# EAGLE design FubarinoMini_v10 (EAGLE 5.10)
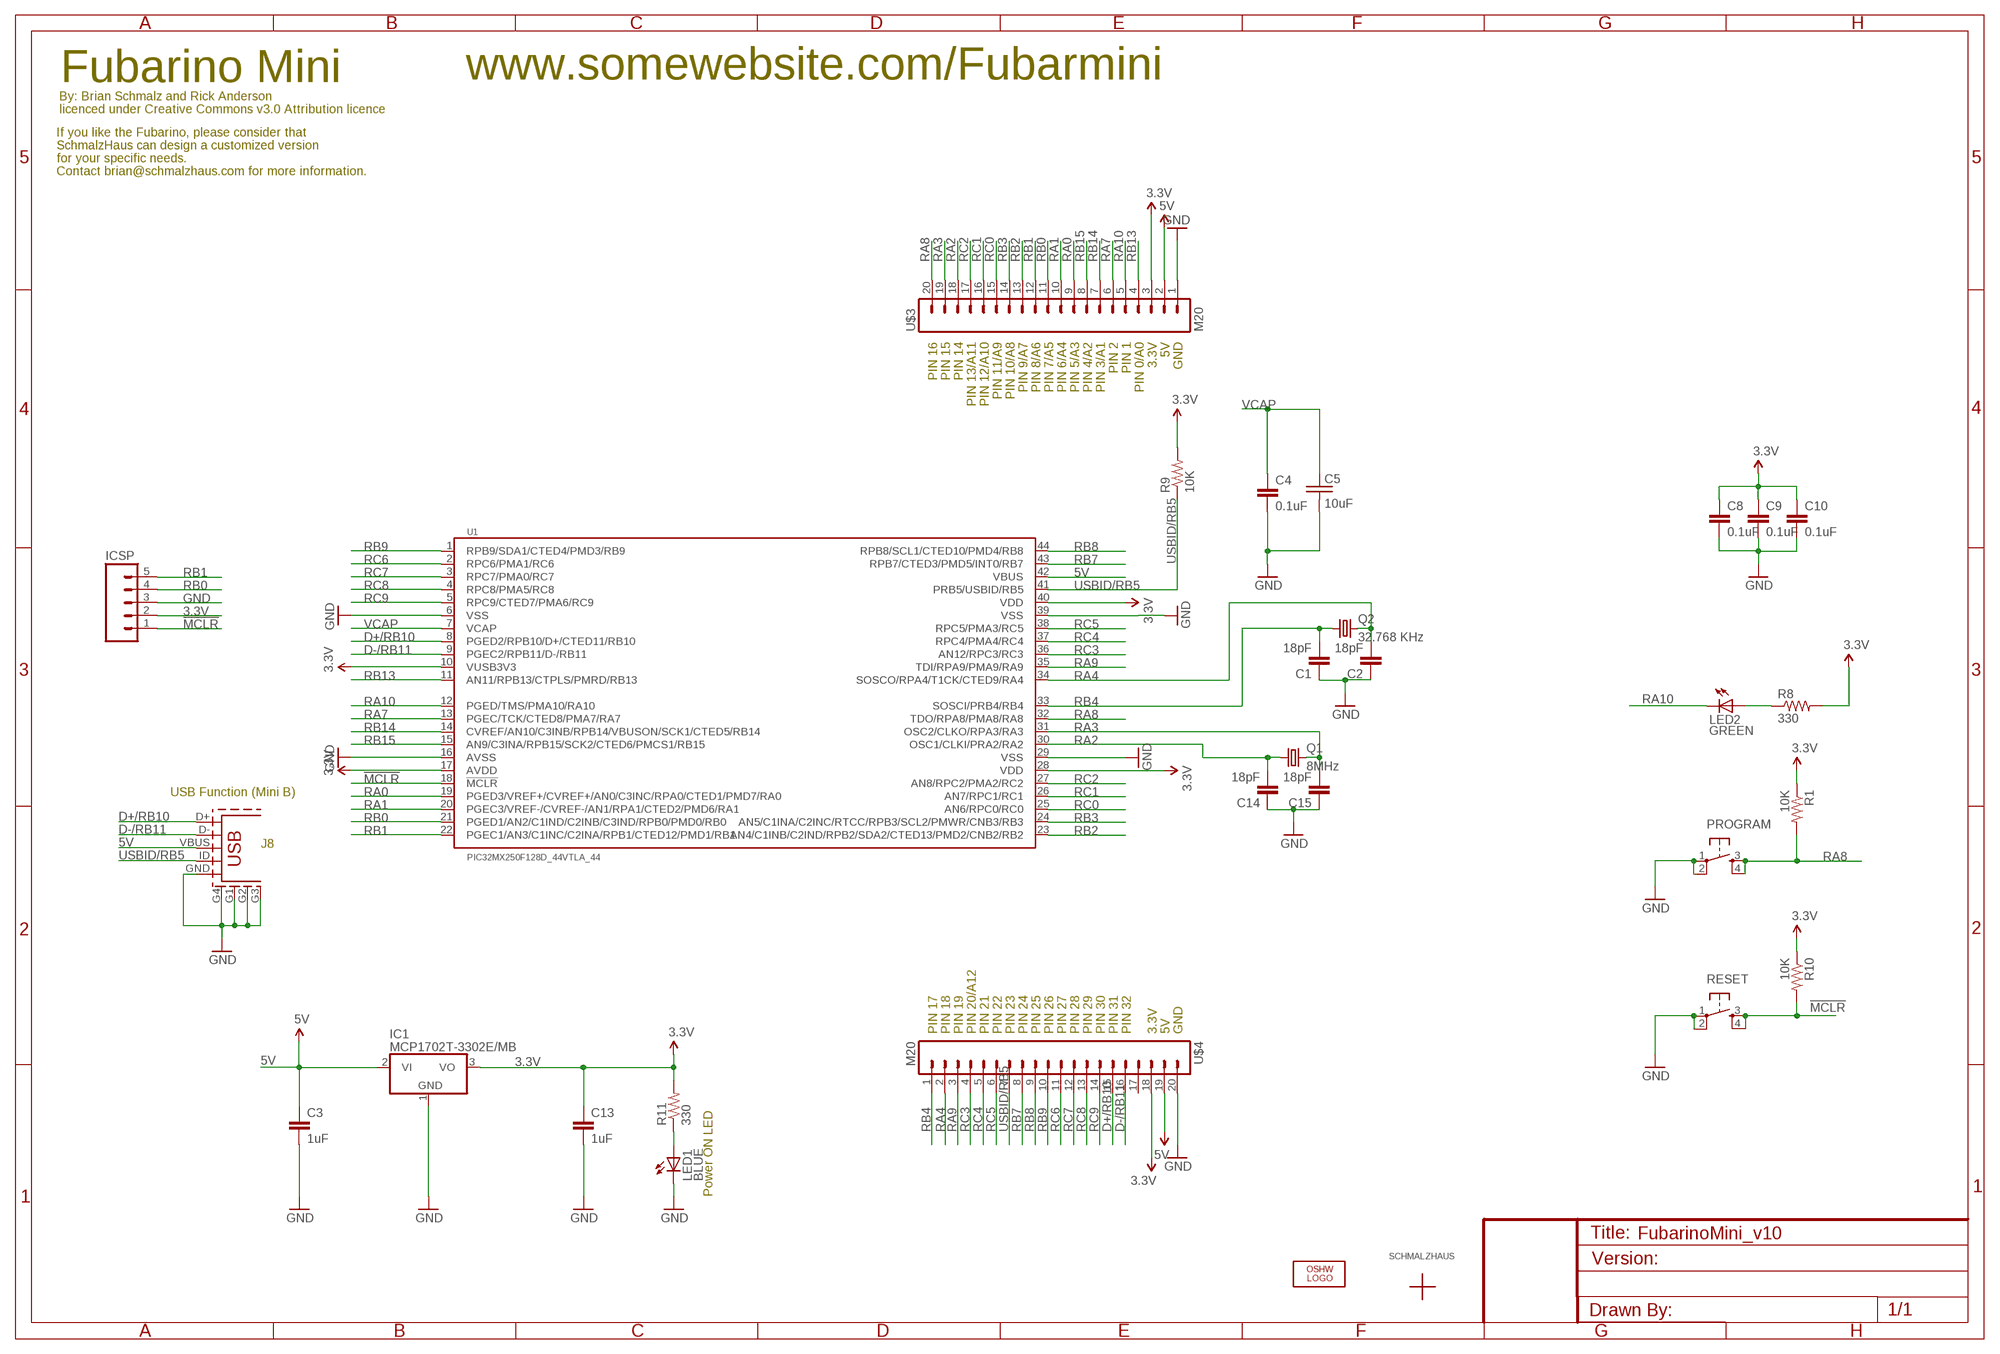
[diagram p0: schematic, sheet 1]

## Parts
C1  18pF  CAP0603-CAP  [0603-CAP]
C2  18pF  CAP0603-CAP  [0603-CAP]
C3  1uF  CAP0603-CAP  [0603-CAP]
C4  0.1uF  CAP0603-CAP  [0603-CAP]
C5  10uF  CAP0805  [CAP_0805]
C8  0.1uF  CAP0603-CAP  [0603-CAP]
C9  0.1uF  CAP0603-CAP  [0603-CAP]
C10  0.1uF  CAP0603  [0603]
C13  1uF  CAP0603  [0603]
C14  18pF  CAP0603-CAP  [0603-CAP]
C15  18pF  CAP0603-CAP  [0603-CAP]
IC1  MCP1702T-3302E/MB  MCP170333MB  [SOT89]
ICSP  M05NOSLILK  [1X05_NOSILK]
J8  USB_5PIN  [USB-MINIB]
LED1  BLUE  LED0603  [LED-0603]
LED2  GREEN  LED0603  [LED-0603]
LOGO1  OSHW_LOGO_8MILX0070-NT  [OSHW_8X70_NOTEXT]
PROGRAM  TAC_SWITCHSND  [TACTILE_SWITCH_SMD]
Q1  8MHz  CRYSTALNX5032  [NX5032_5MM_3.2MM_CRYSTAL]
Q2  32.768 KHz  CRYSTALTC26H  [TC26H]
R1  10K  RESISTOR0603-RES  [0603-RES]
R8  330  RESISTOR0603-RES  [0603-RES]
R9  10K  RESISTOR0603-RES  [0603-RES]
R10  10K  RESISTOR0603-RES  [0603-RES]
R11  330  RESISTOR0603-RES  [0603-RES]
RESET  TAC_SWITCHSND  [TACTILE_SWITCH_SMD]
U1  PIC32MX250F128D_44VTLA_44  PIC32MX2XX_44VLA_44  [VTLA_44]
U$1  SCHMALZHAUSSCHMALZHAUS_SMALL  [SCHMALZHAUS_SMALL]
U$3  M20  [1X20_NO_PIN1]
U$4  M20  [1X20_NO_PIN1]

## Nets
3.3V: C8.1 C9.1 C10.1 C13.1 IC1.3(VO) ICSP.2 R1.1 R8.2 R9.2 R10.1 R11.2 U1.10(VUSB3V3) U1.17(AVDD) U1.28(VDD) U1.40(VDD) U$3.3 U$4.18
5V: C3.1 IC1.2(VI) IC1.2@1(VI1) J8.VBUS U1.42(VBUS) U$3.2 U$4.19
!MCLR!: ICSP.1 R10.2 RESET.3 RESET.4 U1.18(!MCLR!)
D+/RB10: J8.D+ U1.8(PGED2/RPB10/D+/CTED11/RB10) U$4.15
D-/RB11: J8.D- U1.9(PGEC2/RPB11/D-/RB11) U$4.16
GND: C1.1 C2.1 C3.2 C4.2 C5.2 C8.2 C9.2 C10.2 C13.2 C14.1 C15.1 IC1.1(GND) ICSP.3 J8.G1 J8.G2 J8.G3 J8.G4(SHIELD) J8.GND LED1.C PROGRAM.1 PROGRAM.2 RESET.1 RESET.2 U1.6(VSS) U1.16(AVSS) U1.29(VSS) U1.39(VSS) U$3.1 U$4.20
N$6: LED1.A R11.1
N$20: LED2.A R8.1
RA0: U1.19(PGED3/VREF+/CVREF+/AN0/C3INC/RPA0/CTED1/PMD7/RA0) U$3.9
RA1: U1.20(PGEC3/VREF-/CVREF-/AN1/RPA1/CTED2/PMD6/RA1) U$3.10
RA2: C14.2 Q1.1 U1.30(OSC1/CLKI/PRA2/RA2) U$3.18
RA3: C15.2 Q1.2 U1.31(OSC2/CLKO/RPA3/RA3) U$3.19
RA4: C2.2 Q2.2 U1.34(SOSCO/RPA4/T1CK/CTED9/RA4) U$4.2
RA7: U1.13(PGEC/TCK/CTED8/PMA7/RA7) U$3.6
RA8: PROGRAM.3 PROGRAM.4 R1.2 U1.32(TDO/RPA8/PMA8/RA8) U$3.20
RA9: U1.35(TDI/RPA9/PMA9/RA9) U$4.3
RA10: LED2.C U1.12(PGED/TMS/PMA10/RA10) U$3.5
RB0: ICSP.4 U1.21(PGED1/AN2/C1IND/C2INB/C3IND/RPB0/PMD0/RB0) U$3.11
RB1: ICSP.5 U1.22(PGEC1/AN3/C1INC/C2INA/RPB1/CTED12/PMD1/RB1) U$3.12
RB2: U1.23(AN4/C1INB/C2IND/RPB2/SDA2/CTED13/PMD2/CNB2/RB2) U$3.13
RB3: U1.24(AN5/C1INA/C2INC/RTCC/RPB3/SCL2/PMWR/CNB3/RB3) U$3.14
RB4: C1.2 Q2.1 U1.33(SOSCI/PRB4/RB4) U$4.1
RB7: U1.43(RPB7/CTED3/PMD5/INT0/RB7) U$4.8
RB8: U1.44(RPB8/SCL1/CTED10/PMD4/RB8) U$4.9
RB9: U1.1(RPB9/SDA1/CTED4/PMD3/RB9) U$4.10
RB13: U1.11(AN11/RPB13/CTPLS/PMRD/RB13) U$3.4
RB14: U1.14(CVREF/AN10/C3INB/RPB14/VBUSON/SCK1/CTED5/RB14) U$3.7
RB15: U1.15(AN9/C3INA/RPB15/SCK2/CTED6/PMCS1/RB15) U$3.8
RC0: U1.25(AN6/RPC0/RC0) U$3.15
RC1: U1.26(AN7/RPC1/RC1) U$3.16
RC2: U1.27(AN8/RPC2/PMA2/RC2) U$3.17
RC3: U1.36(AN12/RPC3/RC3) U$4.4
RC4: U1.37(RPC4/PMA4/RC4) U$4.5
RC5: U1.38(RPC5/PMA3/RC5) U$4.6
RC6: U1.2(RPC6/PMA1/RC6) U$4.11
RC7: U1.3(RPC7/PMA0/RC7) U$4.12
RC8: U1.4(RPC8/PMA5/RC8) U$4.13
RC9: U1.5(RPC9/CTED7/PMA6/RC9) U$4.14
USBID/RB5: J8.ID(USB_ID) R9.1 U1.41(PRB5/USBID/RB5) U$4.7
VCAP: C4.1 C5.1 U1.7(VCAP)
Unconnected: U$4.17

## Notes on the sheet
- Fubarino Mini | www.somewebsite.com/Fubarmini
- By: Brian Schmalz and Rick Anderson
- licenced under Creative Commons v3.0 Attribution licence
- If you like the Fubarino, please consider that
- SchmalzHaus can design a customized version
- for your specific needs.
- Contact brian@schmalzhaus.com for more information.
- PIN 16 | PIN 15 | PIN 14 | PIN 13/A11 | PIN 12/A10 | PIN 11/A9 | PIN 10/A8 | PIN 9/A7 | PIN 8/A6 | PIN 7/A5 | PIN 6/A4 | PIN 5/A3 | PIN 4/A2 | PIN 3/A1 | PIN 2 | PIN 1 | PIN 0/A0 | 3.3V | 5V | GND
- USB Function (Mini B)
- J8
- PIN 17 | PIN 18 | PIN 19 | PIN 20/A12 | PIN 21 | PIN 22 | PIN 23 | PIN 24 | PIN 25 | PIN 26 | PIN 27 | PIN 28 | PIN 29 | PIN 30 | PIN 31 | PIN 32 | 3.3V | 5V | GND
- Power ON LED

## Library data of the parts
C1-C4 C8 C9 C14 C15 = SparkFun:CAP: Capacitor Standard 0603 ceramic capacitor, and 0.1" leaded capacitor.
C5 = SchmalzHaus:CAP
C10 C13 = SparkFun02-20-08:CAP: Capacitor Standard 0603 ceramic capacitor, and 0.1" leaded capacitor.
IC1 = linear:MCP1703*: 250 mA, 16V, Low Quiescent Current LDO Regulator Source: http://ww1.microchip.com/downloads/en/DeviceDoc/22049b.pdf
ICSP = SchmalzHaus:M05: Header 5 Standard 5-pin 0.1" header. Use with straight break away headers (SKU : PRT-00116), right angle break away headers (PRT-00553), swiss pins (PRT-00743), machine pins (PRT-00117), and female headers (PRT-00115). Molex polarized connector foot print use with SKU : PRT-08230 with associated crimp pins and housings.
J8 = SparkFun02-20-08:USB_5PIN
LED1 LED2 = SparkFun:LED: LEDs Standard schematic elements and footprints for 5mm, 3mm, 1206, and 0603 sized LEDs. 5mm - Spark Fun Electronics SKU : COM-00529 (and others)
LOGO1 = OSHW:OSHW_LOGO_8MIL
PROGRAM RESET = SparkFun02-20-08:TAC_SWITCH: Momentary Switch Button commonly used for reset or general input. Spark Fun Electronics SKU : COM-00097
Q1 Q2 = SchmalzHaus:CRYSTAL: Crystals Various standard crystals. Proven footprints. Spark Fun Electronics SKU : COM-00534
R1 R8-R11 = SparkFun:RESISTOR: Resistor Basic schematic elements and footprints for 0603, 1206, and PTH resistors.
U1 = SchmalzHaus:PIC32MX2XX_44
U$1 = SchmalzHaus:SCHMALZHAUS
U$3 U$4 = SchmalzHaus:M20

## Board
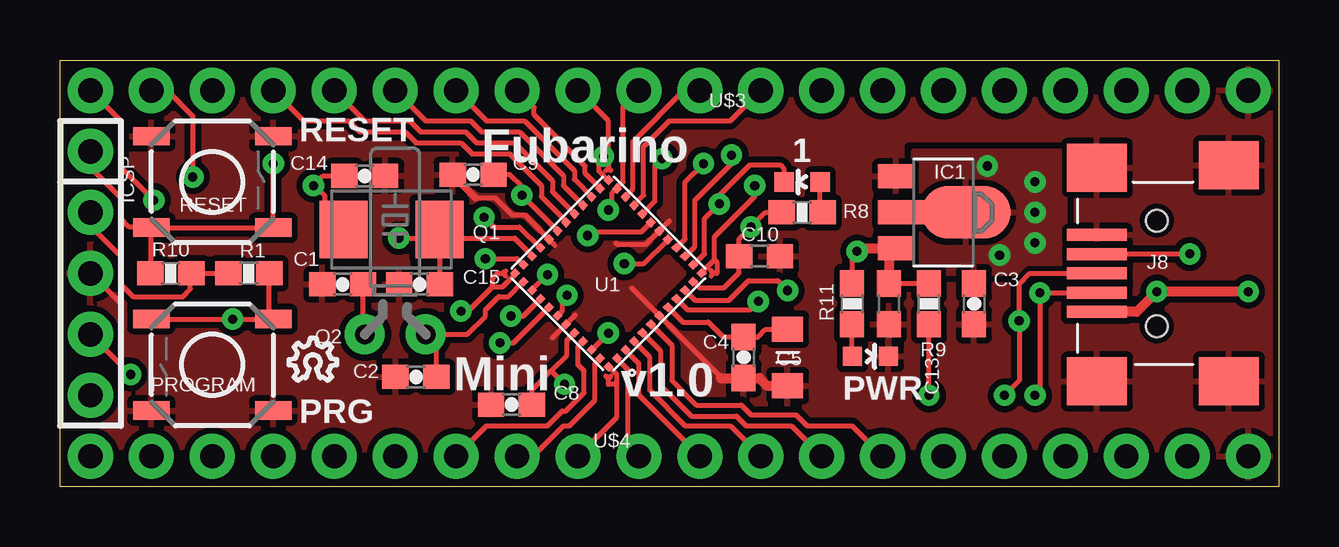
[diagram p1: board, top side]
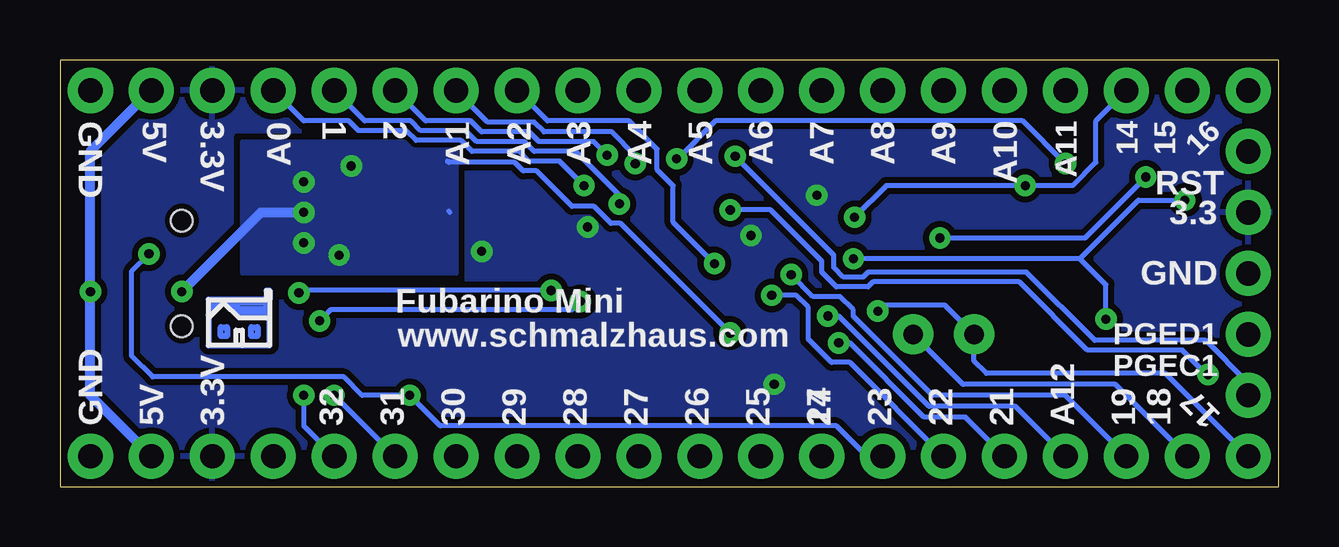
[diagram p2: board, bottom side, seen from below]

Size 50.8 x 17.78 mm. Coordinates in mm from the lower left corner, seen from the top.
Outline: 0,17.78 50.8,17.78 50.8,0 0,0 0,17.78
Copper layers (1*16): Top 0.035mm / dielectric 1.5mm / Bottom 0.035mm
Design rules "GoldPhoenix_8and8": minimum track width 7mil, minimum drill 15mil, track to track 8mil, track to pad 8mil, pad to pad 8mil, via to via 8mil, smd to smd 8mil, copper to edge 10mil, drill to drill 8mil, minimum pad ring 12mil, minimum via ring 10mil, stop-mask expansion 4mil, vias tented up to drill 25mil, thermal gap 10mil

### Footprints (pad centres in the part's own frame; a part is rotated, then mirrored left to right if it is on the bottom)
0603-CAP = smd 1.1 x 1: 1 -0.85,0; 2 0.85,0
CAP_0805 = smd 1.05 x 1.3: 1 -1.175,0; 2 1.175,0
0603 = smd 1.1 x 1: 1 -0.85,0; 2 0.85,0
SOT89 = smd 1 x 1.5: 1 -1.499,-1.981; 3 1.499,-1.981 | smd 1 x 2: 2 0,-1.727 | smd 2.2 x 3.7: 2@1 0,0.94
1X05_NOSILK = drill 1.016 pad 1.88 round: 1 0,0; 2 2.54,0; 3 5.08,0; 4 7.62,0; 5 10.16,0
USB-MINIB = smd 2.5 x 0.5: D+ 2.5,0; D- 2.5,0.8; GND 2.5,-1.6; ID 2.5,-0.8; VBUS 2.5,1.6 | smd 2.5 x 2: G1 -3,4.5; G2 2.5,4.5; G3 -3,-4.5; G4 2.5,-4.4 | hole 0.9: 0,2.2; 0,-2.2
LED-0603 = smd 0.8 x 0.8: A 0,-0.75; C 0,0.75
TACTILE_SWITCH_SMD = smd 1.524 x 0.762: 1 -2.54,1.905; 2 2.54,1.905; 3 -2.54,-1.905; 4 2.54,-1.905
NX5032_5MM_3.2MM_CRYSTAL = smd 2 x 2.4: 1 -2,0; 2 2,0
TC26H = drill 0.813 pad 1.676 round: 1 -1.27,0; 2 1.27,0
0603-RES = smd 1.1 x 1: 1 -0.85,0; 2 0.85,0
VTLA_44 = smd 0.3 x 0.3: 1 -2.75,2.25; 2 -2.75,1.75; 3 -2.75,1.25; 4 -2.75,0.75; 5 -2.75,0.25; 6 -2.75,-0.25; 7 -2.75,-0.75; 8 -2.75,-1.25; 9 -2.75,-1.75; 10 -2.75,-2.25; 11 -2.75,-2.75; 12 -2.25,-2.75; 13 -1.75,-2.75; 14 -1.25,-2.75; 15 -0.75,-2.75; 16 -0.25,-2.75; 17 0.25,-2.75; 18 0.75,-2.75; 19 1.25,-2.75; 20 1.75,-2.75; 21 2.25,-2.75; 22 2.75,-2.75; 23 2.75,-2.25; 24 2.75,-1.75; 25 2.75,-1.25; 26 2.75,-0.75; 27 2.75,-0.25; 28 2.75,0.25; 29 2.75,0.75; 30 2.75,1.25; 31 2.75,1.75; 32 2.75,2.25; 33 2.75,2.75; 34 2.25,2.75; 35 1.75,2.75; 36 1.25,2.75; 37 0.75,2.75; 38 0.25,2.75; 39 -0.25,2.75; 40 -0.75,2.75; 41 -1.25,2.75; 42 -1.75,2.75; 43 -2.25,2.75; 44 -2.75,2.75
1X20_NO_PIN1 = drill 1.016 pad 1.88 round: 1 -24.13,0; 2 -21.59,0; 3 -19.05,0; 4 -16.51,0; 5 -13.97,0; 6 -11.43,0; 7 -8.89,0; 8 -6.35,0; 9 -3.81,0; 10 -1.27,0; 11 1.27,0; 12 3.81,0; 13 6.35,0; 14 8.89,0; 15 11.43,0; 16 13.97,0; 17 16.51,0; 18 19.05,0; 19 21.59,0; 20 24.13,0

### Placement (x,y rotation side)
C1  11.79,8.43 0 top
C2  14.83,4.57 0 top
C3  38.1,7.62 270 top
C4  28.5,5.38 270 top
C5  30.33,5.38 270 top
C8  18.82,3.42 180 top
C9  17.22,13 180 top
C10  29.16,9.6 0 top
C13  34.54,7.62 270 top
C14  12.7,12.95 180 top
C15  14.99,8.43 0 top
IC1  36.83,11.43 270 top
ICSP  1.27,13.97 270 top
J8  45.72,8.89 180 top
LED1  33.78,5.44 270 top
LED2  30.94,12.7 90 top
LOGO1  9.55,4.42 0 top
PROGRAM  6.35,5.08 180 top
Q1  13.82,10.72 0 top
Q2  13.97,6.35 0 top
R1  7.87,8.89 0 top
R8  30.94,11.43 180 top
R9  36.22,7.62 90 top
R10  4.62,8.89 180 top
R11  33.02,7.62 90 top
RESET  6.35,12.7 0 top
U1  22.86,8.89 135 top
U$1  43.33,5.89 0 bottom
U$3  25.4,16.51 180 top
U$4  25.4,1.27 0 top

### Tracks (layer width: path | path; a pad name or v marks a point on that pad's centre or on a via)
3.3V  (via drill 0.38)
  Top 0.203: ICSP.2 1.27,10.87 2.54,9.6 2.54,8.43 3.05,7.92 5.13,7.92 5.44,8.23 5.44,8.85 R10.1 R1.1 | U1.28 v19.25,12.14 19.25,12.5 18.75,13.01 C9.1 | U1.40 21.13,6.1 21.13,5.49 20.47,4.83 | C13.1 R9.2 | U1.17 24.23,10.62 22.15,10.62 v22,10.46 | U1.10 26.41,8.54 26.67,8.28 27.67,8.28 28.31,8.92 C10.1 28.31,10.33 v28.8,10.82 29.41,11.43 R8.2 | 33.33,9.91 v33.22,9.8 33.02,9.6 R11.2 | IC1.3 34.54,9.63 | C8.1 19.67,4.02 20.47,4.83 | 20.47,4.83 v21.03,4.27
  Top 0.406: IC1.3 34.82,9.91 33.33,9.91 | 34.54,9.63 C13.1
  Bottom 0.203: v22,10.46 22,10.21
  pour Bottom (isolate 0.254, rank 3): 0,0 0,17.78 50.8,17.78 50.8,0
5V  (via drill 0.38)
  Top 0.203: U1.42 22.17,5.71 v22.86,6.4
  Top 0.406: J8.VBUS 44.88,7.29 v45.72,8.13 v49.53,8.13
  Bottom 0.203: v49.53,8.13 49.48,8.13 49.53,8.08 | 34.59,11.48 34.54,11.43 | v22.86,6.4 27.43,10.97 27.84,10.97 28.55,11.68 29.46,11.68 30.94,13.16 31.5,13.16 31.85,13.51 34.59,13.51 34.65,13.56
  Bottom 0.406: U$3.2 49.53,13.97 49.53,8.08 49.53,3.81 U$4.19 | v45.72,8.13 42.42,11.43 v40.64,11.43
  other vias: 40.64,12.7 40.64,10.16 38.66,13.36 39.17,9.65
  pour Top: 35.56,8.89 41.91,8.89 41.91,13.97 35.56,13.97
  pour Bottom: 34.29,14.38 34.29,8.89 43.18,8.89 43.18,14.38
!MCLR!  (via drill 0.38)
  Top 0.203: RESET.3 RESET.4 v8.89,13.46 | U1.18 24.27,11.37 24.79,11.89 24.79,13.36 v25.09,13.66 | RESET.3 3.81,8.93 R10.2 | ICSP.1 1.27,13.31 2.54,12.04 2.54,11.18 2.9,10.82 3.79,10.82 RESET.3
  Bottom 0.203: v8.89,13.46 10.67,15.24 23.47,15.24 25.04,13.66 v25.09,13.66
D+/RB10  (via drill 0.38)
  Top 0.203: U1.8 26.16,7.37 28.75,7.37 v29.11,7.72 | J8.D+ 40.44,8.89 39.98,8.43 v39.98,6.91 39.98,4.42 v39.37,3.81
  Bottom 0.203: v29.11,7.72 29.46,7.37 39.52,7.37 v39.98,6.91 | v39.37,3.81 U$4.15
D-/RB11  (via drill 0.38)
  Top 0.203: U1.9 26.06,8.18 26.47,7.77 27.89,7.77 28.7,8.59 29.92,8.59 v30.33,8.18 | J8.D- 43.21,8.08 v40.84,8.08 40.84,4.01 v40.64,3.81
  Bottom 0.203: v30.33,8.18 40.74,8.18 v40.84,8.08 | v40.64,3.81 40.64,2.54 U$4.16
GND
  Top 0.203: U1.29 | U1.16 | U1.16 25.4,11.07 | U1.29 20.62,10.06 | 23.82,8.28 U1.6 27.53,4.57 27.53,4.52 | ICSP.3 2.44,7.72 | 21.49,7.16 U1.39 20.52,6.2 | C5.2 | U1.29 19.36,11.33 18.85,11.33 18.14,12.04 17.32,12.04 | 16.51,12.85 16.51,12.87 C9.2 | U1.16 24.43,10.11 23.22,10.11 23.16,10.16
  Top 0.305: 17.32,12.04 16.51,12.85
  Top 0.406: 27.53,4.52 29.16,4.52 29.46,4.22 C5.2
  pour Top (isolate 0.254, rank 4): 0,17.78 0,0 50.8,0 50.8,17.78
N$6
  Top 0.203: R11.1 LED1.A
N$20
  Top 0.203: LED2.A 31.69,11.53 R8.1
RA0
  Top 0.203: U1.19 24.33,12.14 24.33,14.17 25.4,15.24 27.94,15.24 U$3.9
RA1
  Top 0.203: U1.20 23.57,12.09 23.88,12.39 23.88,14.38 26.01,16.51 U$3.10
RA2  (via drill 0.38)
  Top 0.203: U1.30 19.15,10.82 18.09,10.82 v17.68,11.23 | C14.2 10.97,12.95 v10.57,12.55 10.62,12.55 11.02,12.14 11.02,11.51 Q1.1
  Bottom 0.203: v17.68,11.23 16.36,12.55 v10.57,12.55 8.59,12.55 7.62,13.51 7.62,15.24 U$3.18
RA3  (via drill 0.38)
  Top 0.203: U1.31 19.68,9.63 18.95,10.36 16.17,10.36 Q1.2 | Q1.2 15.82,8.45 C15.2 | Q1.2 15.7,10.72 15.34,10.36 v14.12,10.36 | v5.54,12.9 5.54,15.44 4.47,16.51 U$3.19
  Bottom 0.203: v14.12,10.36 8.08,10.36 v5.54,12.9
RA4
  Top 0.203: 19.32,8.55 U1.34 19.31,8.54 18.69,7.92 18.29,7.92 17.73,7.37 17.73,7.11 16.97,6.35 Q2.2 15.68,5.91 C2.2
  Bottom 0.203: U$4.2 6.81,4.27 13.16,4.27 Q2.2
RA7  (via drill 0.38)
  Top 0.203: U1.13 26.04,9.58 26.47,10.01 26.47,11.94 27.99,13.46 v27.99,13.82
  Bottom 0.203: v27.99,13.82 28.55,14.38 30.84,14.38 31.24,14.78 33.22,14.78 33.68,15.24 35.56,15.24 U$3.6
RA8  (via drill 0.38)
  Top 0.203: U1.32 19.31,9.24 19.05,9.5 v17.73,9.5 | PROGRAM.4 v7.2,6.99 PROGRAM.3 8.72,7.15 R1.2 | v3.91,11.94 2.54,13.31 2.54,15.24 U$3.20
  Bottom 0.203: 8.28,9.5 v17.73,9.5 | v7.2,6.99 7.2,8.42 8.28,9.5 | 8.28,9.5 5.84,11.94 v3.91,11.94
RA9  (via drill 0.38)
  Top 0.203: 19.66,8.18 U1.35 19.68,8.2 v20.32,8.84
  Bottom 0.203: U$4.3 8.89,3.81 14.43,3.81 17.73,7.11 17.73,7.37 18.29,7.92 19.41,7.92 v20.32,8.84
RA10  (via drill 0.38)
  Top 0.203: U1.12 26.39,9.22 26.87,9.7 26.87,11.18 v27.48,11.79 27.48,12.14 28.75,13.41 30.02,13.41 30.18,13.26 30.18,12.71 LED2.C
  Bottom 0.203: v27.48,11.79 27.48,12.14 29.31,13.97 31.04,13.97 31.45,14.38 33.43,14.38 33.88,14.83 35.76,14.83 36.17,15.24 38.1,15.24 U$3.5
RB0  (via drill 0.38)
  Top 0.203: 23.21,12.44 U1.21 | 23.21,12.44 23.47,12.7 23.47,15.85 U$3.11 | ICSP.4 v2.95,4.67 | 23.21,12.44 23.01,12.24 23.01,11.68 v22.86,11.53
  Bottom 0.203: v2.95,4.67 3,4.67 4.01,5.69 7.98,5.69 10.82,8.53 16.92,8.53 17.12,8.33 18.44,8.33 19.05,8.94 19.05,9.4 21.18,11.53 v22.86,11.53
RB1  (via drill 0.38)
  Top 0.203: U$3.12 22.86,15.24 22.86,13.97 v22.66,13.77 | U1.22 22.83,12.78 22.45,13.16 22.45,13.56 v22.66,13.77 | 22.86,13.28 22.76,13.17 | 22.86,13.28 22.97,13.17 | v22.66,13.77 22.86,13.56 22.86,13.28
  Bottom 0.203: ICSP.5 1.27,4.32 3.05,6.1 7.67,6.1 10.52,8.94 17.12,8.94 17.32,8.74 18.14,8.74 18.54,9.14 18.54,9.65 v22.66,13.77
RB2
  Top 0.203: U1.23 22.51,12.44 21.89,13.06 21.89,13.36 19.76,15.49 19.76,15.8 U$3.13
RB3
  Top 0.203: U1.24 22.15,12.09 21.44,12.8 21.44,13.16 19.36,15.24 17.78,15.24 U$3.14
RB4  (via drill 0.38)
  Top 0.203: C1.2 12.64,6.41 Q2.1 | v16.71,7.32 17.02,7.32 18.03,8.33 | U1.33 18.97,8.86 18.44,8.33 18.03,8.33 | 18.48,8.89 18.58,9 | 18.48,8.89 | 18.48,8.89 18.58,8.78 | 18.03,8.33 18.03,8.69 18.24,8.89 18.48,8.89 | 18.48,8.89
  Bottom 0.203: v16.71,7.32 16.46,7.57 13.92,7.57 Q2.1 12.7,5.23 12.19,4.72 4.72,4.72 U$4.1
RB7
  Top 0.203: U1.43 22.51,5.34 22.3,5.13 22.3,3.61 21.23,2.54 20.98,2.54 19.71,1.27 U$4.8
RB8
  Top 0.203: U1.44 22.89,5 23.22,4.67 23.22,4.27 | 23.22,4.27 23.22,2.9 U$4.9 | 22.86,4.51 22.75,4.61 | 22.86,4.51 22.97,4.61 | 23.22,4.27 22.86,4.27 22.86,4.51
RB9
  Top 0.203: U1.1 23.21,5.34 23.67,4.88 23.67,1.73 U$4.10
RB13  (via drill 0.38)
  Top 0.203: U1.11 26.75,8.92 27.28,9.45 | 27.28,9.45 27.28,10.41 28.96,12.09 v28.96,12.55 | 27.24,8.89 27.13,9 | 27.24,8.89 | 27.24,8.89 27.14,8.78 | 27.28,9.45 27.38,9.35 27.38,8.89 27.24,8.89 | 27.24,8.89
  Bottom 0.203: v28.96,12.55 29.97,13.56 31.24,13.56 31.65,13.97 33.63,13.97 34.09,14.43 35.97,14.43 36.37,14.83 38.35,14.83 38.76,15.24 40.64,15.24 U$3.4
RB14  (via drill 0.38)
  Top 0.203: U1.14 26.06,10.31 26.06,12.7 v26.82,13.46
  Bottom 0.203: v26.82,13.46 26.82,13.82 27.79,14.78 30.63,14.78 31.04,15.19 32.97,15.19 U$3.7
RB15  (via drill 0.38)
  Top 0.203: U1.15 24.33,9.3 v23.52,9.3
  Bottom 0.203: v23.52,9.3 25.25,11.02 25.25,12.55 25.91,13.21 25.91,14.07 27.08,15.24 30.48,15.24 U$3.8
RC0
  Top 0.203: U1.25 20.98,12.55 20.98,12.95 19.15,14.78 17.58,14.78 17.12,15.24 15.24,15.24 U$3.15
RC1
  Top 0.203: U1.26 21.45,11.37 20.52,12.29 20.52,12.75 18.95,14.33 17.37,14.33 16.92,14.78 15.04,14.78 14.58,15.24 12.7,15.24 U$3.16
RC2
  Top 0.203: U1.27 21.09,11.06 20.07,12.09 20.07,12.55 18.75,13.87 17.17,13.87 16.71,14.33 14.83,14.33 14.38,14.78 12.5,14.78 12.04,15.24 10.16,15.24 U$3.17
RC3  (via drill 0.38)
  Top 0.203: U1.36 19.3,7.11 v18.8,7.11
  Bottom 0.203: v18.8,7.11 18.34,7.11 14.58,3.35 10.97,3.35 U$4.4
RC4  (via drill 0.38)
  Top 0.203: U1.37 18.9,5.99 v18.34,5.99
  Bottom 0.203: U$4.5 13.06,2.9 14.78,2.9 17.88,5.99 v18.34,5.99
RC5  (via drill 0.38)
  Top 0.203: U1.38 20.93,7.32 20.93,7.77 v21.13,7.98
  Bottom 0.203: v21.13,7.98 20.12,7.98 19.61,7.47 19.61,6.15 18.64,5.18 17.88,5.18 U$4.6
RC6
  Top 0.203: U1.2 23.57,5.69 24.13,5.13 24.13,3.81 U$4.11
RC7
  Top 0.203: U1.3 24.59,5.38 24.59,4.01 26.06,2.54 27.94,2.54 U$4.12
RC8
  Top 0.203: U1.4 25.04,5.64 25.04,4.22 26.31,2.95 28.19,2.95 28.6,2.54 30.48,2.54 U$4.13
RC9
  Top 0.203: U1.5 25.5,5.89 25.5,4.42 26.52,3.4 28.4,3.4 28.8,3 30.68,3 31.14,2.54 33.02,2.54 U$4.14
USBID/RB5  (via drill 0.38)
  Top 0.203: U1.41 21.59,5.84 21.59,5.08 21.84,4.83 21.84,3.91 21.08,3.15 20.93,3.15 20.32,2.54 17.78,2.54 U$4.7 | v36.22,3.81 R9.1 | J8.ID v47.08,9.69 v47.09,9.7
  Bottom 0.203: U$4.7 17.17,1.27 18.44,2.54 34.95,2.54 v36.22,3.81 38.2,3.81 38.96,4.57 46.94,4.57 47.8,5.44 47.8,8.99 v47.09,9.7
VCAP
  Top 0.203: U1.7 25.34,7.48 25.96,6.86 27.03,6.86 27.64,6.25 28.48,6.25 C4.1 29.09,6.24 29.41,6.55 C5.1

### Text on the board
tPlace: RESET | Fubarino | 1 | Mini | v1.0 | PWR | PRG
bPlace: 16 | 15 | 14 | A11 | A10 | A9 | A8 | A7 | A6 | A5 | A4 | A3 | A2 | A1 | 2 | 1 | A0 | 3.3V | 5V | GND | RST | 3.3 | GND | PGED1 | Fubarino Mini | PGEC1 | www.schmalzhaus.com | 17 | 18 | 19 | A12 | 21 | 22 | 23 | 17 | 24 | 25 | 26 | 27 | 28 | 29 | 30 | 31 | 32 | 3.3V | 5V | GND